# Altium schematic sheet NEB_TOP_CYCLONE.SchDoc: NEB - Cyclone Top
size A4; Organization: Altium Limited; Address1: L3, 12a Rodborough Rd; Address2: Frenchs Forest; Address3: NSW; Address4: Australia 2086; DocumentNumber: 1; SheetNumber: 1; SheetTotal: 10
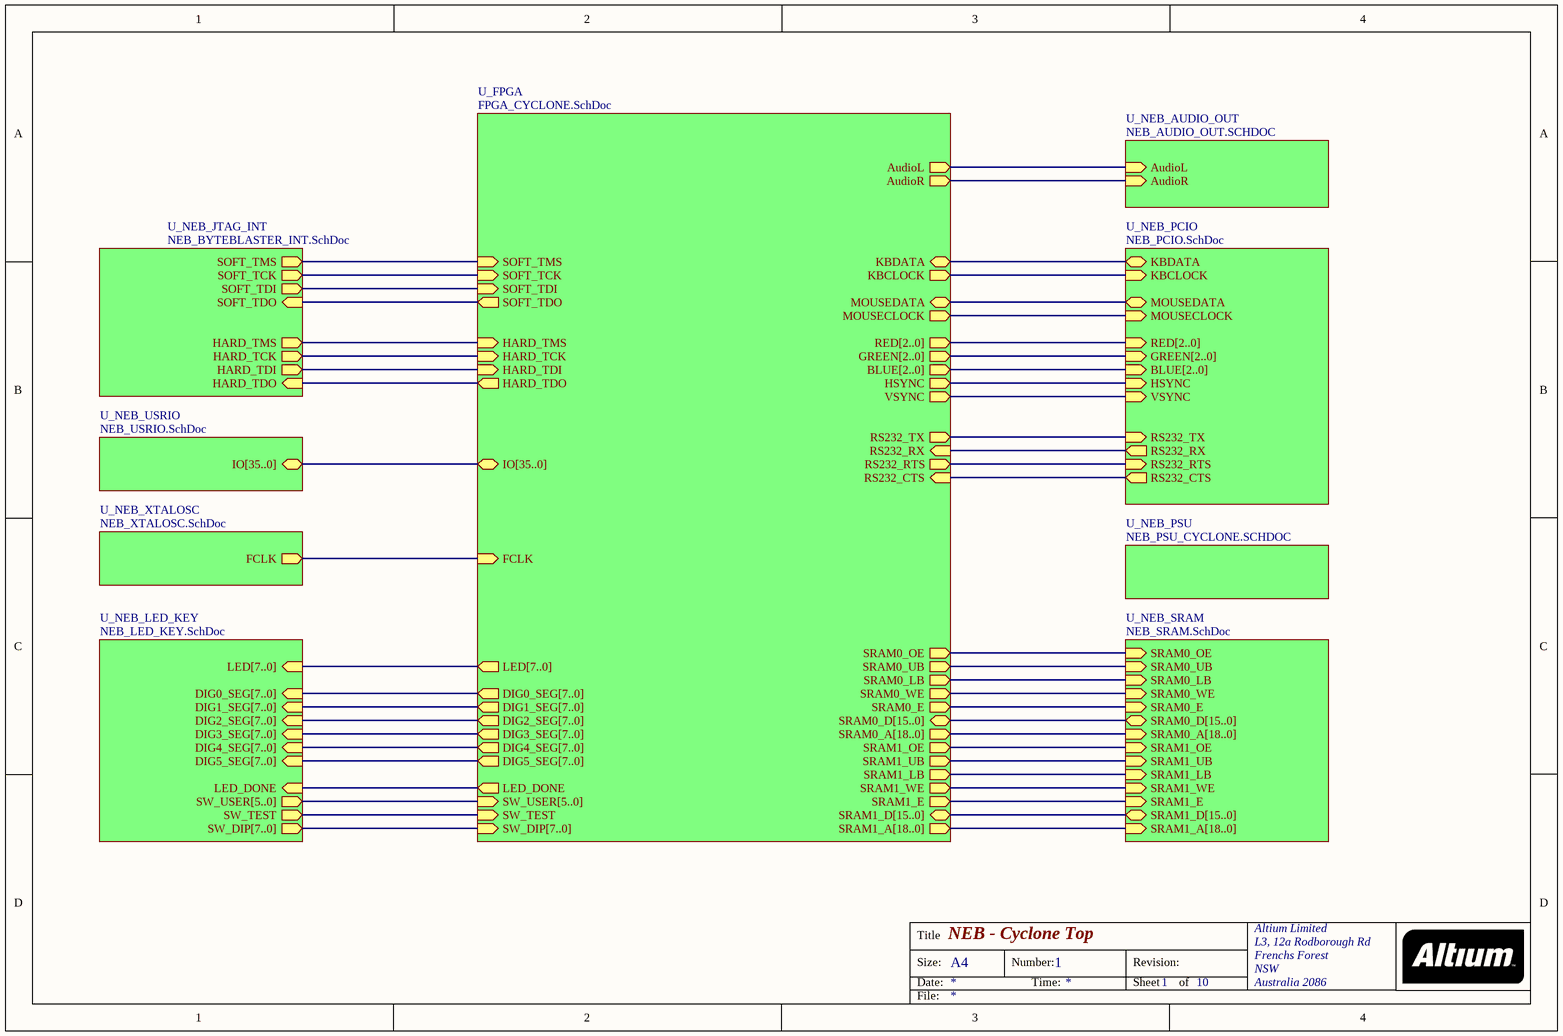
[diagram p0: NEB_TOP_CYCLONE.SchDoc]

## Sub-sheets
U_FPGA = FPGA_CYCLONE.SchDoc: SOFT_TMS (in), SOFT_TCK (in), SOFT_TDI (in), SOFT_TDO (out), HARD_TMS (in), HARD_TCK (in), HARD_TDI (in), HARD_TDO (out), IO[35..0] (bidir), FCLK (in), LED[7..0] (out), DIG1_SEG[7..0] (out), DIG0_SEG[7..0] (out), DIG2_SEG[7..0] (out), DIG3_SEG[7..0] (out), LED_DONE (out), SW_USER[5..0] (in), SRAM1_E (out), SRAM1_WE (out), SRAM1_LB (out), SRAM1_UB (out), SRAM1_OE (out), SRAM0_E (out), SRAM0_WE (out), SRAM0_LB (out), SRAM0_UB (out), SRAM0_OE (out), SRAM0_A[18..0] (out), SRAM1_A[18..0] (out), RS232_RTS (out), RS232_TX (out), VSYNC (out), HSYNC (out), BLUE[2..0] (out), GREEN[2..0] (out), RED[2..0] (out), MOUSECLOCK (out), KBCLOCK (out), AudioR (out), AudioL (out), SW_TEST (in), SW_DIP[7..0] (in), RS232_RX (in), RS232_CTS (in), KBDATA (bidir), MOUSEDATA (bidir), SRAM0_D[15..0] (bidir), SRAM1_D[15..0] (bidir), DIG4_SEG[7..0] (out), DIG5_SEG[7..0] (out)
U_NEB_AUDIO_OUT = NEB_AUDIO_OUT.SCHDOC: AudioL (in), AudioR (in)
U_NEB_JTAG_INT = NEB_BYTEBLASTER_INT.SchDoc: SOFT_TCK (out), SOFT_TDI (out), SOFT_TMS (out), SOFT_TDO (in), HARD_TMS (out), HARD_TCK (out), HARD_TDI (out), HARD_TDO (in)
U_NEB_LED_KEY = NEB_LED_KEY.SchDoc: LED[7..0] (in), SW_DIP[7..0] (out), DIG0_SEG[7..0] (in), DIG1_SEG[7..0] (in), DIG2_SEG[7..0] (in), DIG3_SEG[7..0] (in), SW_TEST (out), SW_USER[5..0] (out), LED_DONE (in), DIG4_SEG[7..0] (in), DIG5_SEG[7..0] (in)
U_NEB_PCIO = NEB_PCIO.SchDoc: RS232_RTS (in), RS232_TX (in), RS232_CTS (out), RS232_RX (out), KBDATA (bidir), KBCLOCK (in), MOUSEDATA (bidir), MOUSECLOCK (in), RED[2..0] (in), GREEN[2..0] (in), HSYNC (in), VSYNC (in), BLUE[2..0] (in)
U_NEB_PSU = NEB_PSU_CYCLONE.SCHDOC: no entries
U_NEB_SRAM = NEB_SRAM.SchDoc: SRAM0_OE (in), SRAM0_UB (in), SRAM0_LB (in), SRAM0_WE (in), SRAM0_E (in), SRAM0_D[15..0] (bidir), SRAM0_A[18..0] (in), SRAM1_OE (in), SRAM1_UB (in), SRAM1_LB (in), SRAM1_WE (in), SRAM1_E (in), SRAM1_D[15..0] (bidir), SRAM1_A[18..0] (in)
U_NEB_USRIO = NEB_USRIO.SchDoc: IO[35..0] (bidir)
U_NEB_XTALOSC = NEB_XTALOSC.SchDoc: FCLK (out)

## Nets
(unnamed): sheet U_NEB_JTAG_INT/SOFT_TCK, sheet U_FPGA/SOFT_TCK
(unnamed): sheet U_NEB_JTAG_INT/SOFT_TDI, sheet U_FPGA/SOFT_TDI
(unnamed): sheet U_NEB_JTAG_INT/SOFT_TMS, sheet U_FPGA/SOFT_TMS
(unnamed): sheet U_NEB_JTAG_INT/SOFT_TDO, sheet U_FPGA/SOFT_TDO
(unnamed): sheet U_NEB_JTAG_INT/HARD_TMS, sheet U_FPGA/HARD_TMS
(unnamed): sheet U_NEB_JTAG_INT/HARD_TCK, sheet U_FPGA/HARD_TCK
(unnamed): sheet U_NEB_JTAG_INT/HARD_TDI, sheet U_FPGA/HARD_TDI
(unnamed): sheet U_NEB_JTAG_INT/HARD_TDO, sheet U_FPGA/HARD_TDO
(unnamed): sheet U_NEB_AUDIO_OUT/AudioL, sheet U_FPGA/AudioL
(unnamed): sheet U_NEB_AUDIO_OUT/AudioR, sheet U_FPGA/AudioR
(unnamed): sheet U_NEB_LED_KEY/SW_TEST, sheet U_FPGA/SW_TEST
(unnamed): sheet U_NEB_LED_KEY/LED_DONE, sheet U_FPGA/LED_DONE
(unnamed): sheet U_NEB_SRAM/SRAM0_OE, sheet U_FPGA/SRAM0_OE
(unnamed): sheet U_NEB_SRAM/SRAM0_UB, sheet U_FPGA/SRAM0_UB
(unnamed): sheet U_NEB_SRAM/SRAM0_LB, sheet U_FPGA/SRAM0_LB
(unnamed): sheet U_NEB_SRAM/SRAM0_WE, sheet U_FPGA/SRAM0_WE
(unnamed): sheet U_NEB_SRAM/SRAM0_E, sheet U_FPGA/SRAM0_E
(unnamed): sheet U_NEB_SRAM/SRAM1_OE, sheet U_FPGA/SRAM1_OE
(unnamed): sheet U_NEB_SRAM/SRAM1_UB, sheet U_FPGA/SRAM1_UB
(unnamed): sheet U_NEB_SRAM/SRAM1_LB, sheet U_FPGA/SRAM1_LB
(unnamed): sheet U_NEB_SRAM/SRAM1_WE, sheet U_FPGA/SRAM1_WE
(unnamed): sheet U_NEB_SRAM/SRAM1_E, sheet U_FPGA/SRAM1_E
(unnamed): sheet U_NEB_XTALOSC/FCLK, sheet U_FPGA/FCLK
(unnamed): sheet U_NEB_PCIO/RS232_RTS, sheet U_FPGA/RS232_RTS
(unnamed): sheet U_NEB_PCIO/RS232_TX, sheet U_FPGA/RS232_TX
(unnamed): sheet U_NEB_PCIO/RS232_CTS, sheet U_FPGA/RS232_CTS
(unnamed): sheet U_NEB_PCIO/RS232_RX, sheet U_FPGA/RS232_RX
(unnamed): sheet U_NEB_PCIO/KBDATA, sheet U_FPGA/KBDATA
(unnamed): sheet U_NEB_PCIO/KBCLOCK, sheet U_FPGA/KBCLOCK
(unnamed): sheet U_NEB_PCIO/MOUSEDATA, sheet U_FPGA/MOUSEDATA
(unnamed): sheet U_NEB_PCIO/MOUSECLOCK, sheet U_FPGA/MOUSECLOCK
(unnamed): sheet U_NEB_PCIO/HSYNC, sheet U_FPGA/HSYNC
(unnamed): sheet U_NEB_PCIO/VSYNC, sheet U_FPGA/VSYNC

## Buses and harness runs
bus sheet U_FPGA/BLUE[2..0] = sheet U_NEB_PCIO/BLUE[2..0]
bus sheet U_FPGA/DIG0_SEG[7..0] = sheet U_NEB_LED_KEY/DIG0_SEG[7..0]
bus sheet U_FPGA/DIG1_SEG[7..0] = sheet U_NEB_LED_KEY/DIG1_SEG[7..0]
bus sheet U_FPGA/DIG2_SEG[7..0] = sheet U_NEB_LED_KEY/DIG2_SEG[7..0]
bus sheet U_FPGA/DIG3_SEG[7..0] = sheet U_NEB_LED_KEY/DIG3_SEG[7..0]
bus sheet U_FPGA/DIG4_SEG[7..0] = sheet U_NEB_LED_KEY/DIG4_SEG[7..0]
bus sheet U_FPGA/DIG5_SEG[7..0] = sheet U_NEB_LED_KEY/DIG5_SEG[7..0]
bus sheet U_FPGA/GREEN[2..0] = sheet U_NEB_PCIO/GREEN[2..0]
bus sheet U_FPGA/IO[35..0] = sheet U_NEB_USRIO/IO[35..0]
bus sheet U_FPGA/LED[7..0] = sheet U_NEB_LED_KEY/LED[7..0]
bus sheet U_FPGA/RED[2..0] = sheet U_NEB_PCIO/RED[2..0]
bus sheet U_FPGA/SRAM0_A[18..0] = sheet U_NEB_SRAM/SRAM0_A[18..0]
bus sheet U_FPGA/SRAM0_D[15..0] = sheet U_NEB_SRAM/SRAM0_D[15..0]
bus sheet U_FPGA/SRAM1_A[18..0] = sheet U_NEB_SRAM/SRAM1_A[18..0]
bus sheet U_FPGA/SRAM1_D[15..0] = sheet U_NEB_SRAM/SRAM1_D[15..0]
bus sheet U_FPGA/SW_DIP[7..0] = sheet U_NEB_LED_KEY/SW_DIP[7..0]
bus sheet U_FPGA/SW_USER[5..0] = sheet U_NEB_LED_KEY/SW_USER[5..0]

## Notes on the sheet
- Title
- Size:
- Date:
- A4
- Number:
- Time:
- Revision:
- Sheet
- of
- File: